# EAGLE design Adafruit_NeoParticle24 (EAGLE 6.6.0)
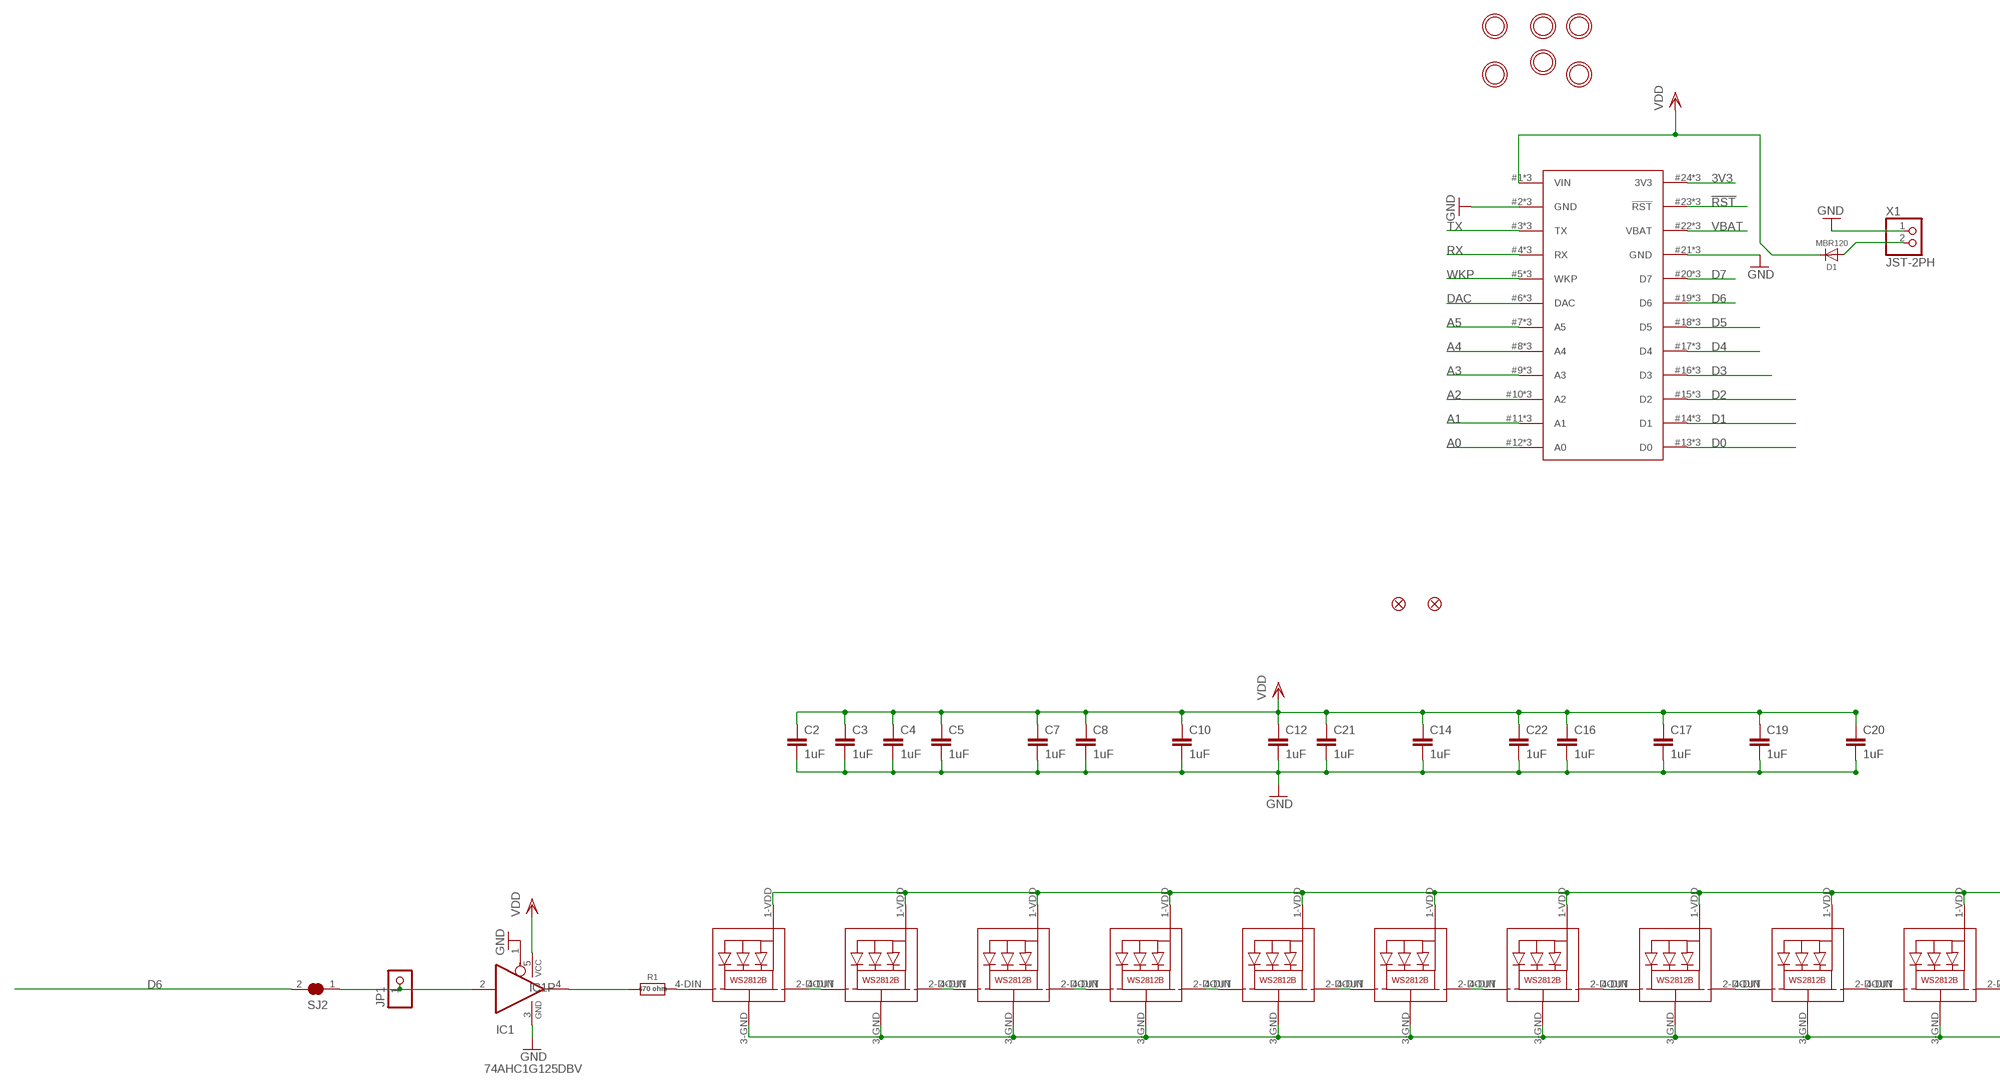
[diagram p0: schematic, sheet 1, part 1 of 2]
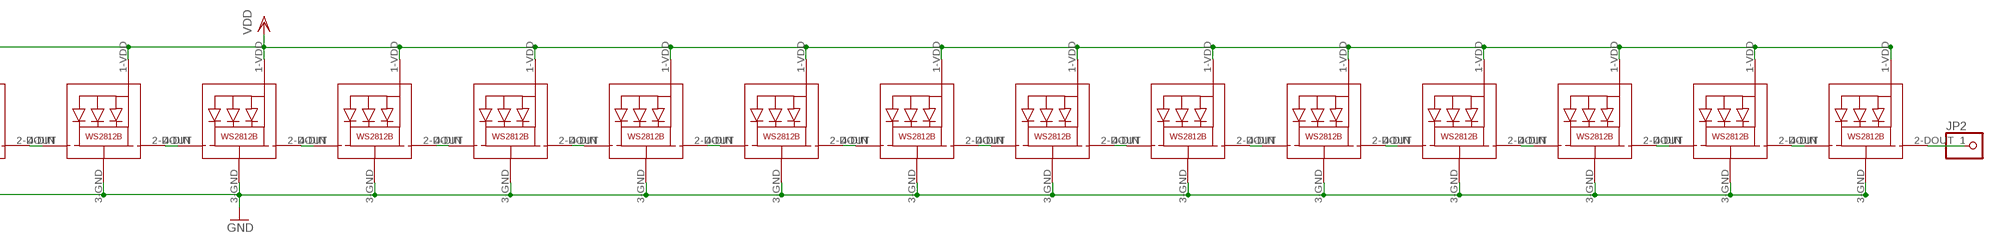
[diagram p1: schematic, sheet 1, part 2 of 2]

## Parts
C2  1uF  C-EUC0603  [C0603]
C3  1uF  C-EUC0603  [C0603]
C4  1uF  C-EUC0603  [C0603]
C5  1uF  C-EUC0603  [C0603]
C7  1uF  C-EUC0603  [C0603]
C8  1uF  C-EUC0603  [C0603]
C10  1uF  C-EUC0603  [C0603]
C12  1uF  C-EUC0603  [C0603]
C14  1uF  C-EUC0603  [C0603]
C16  1uF  C-EUC0603  [C0603]
C17  1uF  C-EUC0603  [C0603]
C19  1uF  C-EUC0603  [C0603]
C20  1uF  C-EUC0603  [C0603]
C21  1uF  C-EUC0603  [C0603]
C22  1uF  C-EUC0603  [C0603]
D1  MBR120  DIODESOD-123  [SOD-123]
FID1  FIDUCIAL""  [FIDUCIAL_1MM]
FID2  FIDUCIAL""  [FIDUCIAL_1MM]
IC1  74AHC1G125DBV  [SOT23-5]
JP1  HEADER-1X1ROUND  [1X01_ROUND]
JP2  PINHD-1X1CB  [1X01-CLEANBIG]
LED1  WS2812B5050  WS2812B5050-NARROW  [WS2812B-NARROW]
LED2  WS2812B5050  WS2812B5050-NARROW  [WS2812B-NARROW]
LED3  WS2812B5050  WS2812B5050-NARROW  [WS2812B-NARROW]
LED4  WS2812B5050  WS2812B5050-NARROW  [WS2812B-NARROW]
LED5  WS2812B5050  WS2812B5050-NARROW  [WS2812B-NARROW]
LED6  WS2812B5050  WS2812B5050-NARROW  [WS2812B-NARROW]
LED7  WS2812B5050  WS2812B5050-NARROW  [WS2812B-NARROW]
LED8  WS2812B5050  WS2812B5050-NARROW  [WS2812B-NARROW]
LED9  WS2812B5050  WS2812B5050-NARROW  [WS2812B-NARROW]
LED10  WS2812B5050  WS2812B5050-NARROW  [WS2812B-NARROW]
LED11  WS2812B5050  WS2812B5050-NARROW  [WS2812B-NARROW]
LED12  WS2812B5050  WS2812B5050-NARROW  [WS2812B-NARROW]
LED13  WS2812B5050  WS2812B5050-NARROW  [WS2812B-NARROW]
LED14  WS2812B5050  WS2812B5050-NARROW  [WS2812B-NARROW]
LED15  WS2812B5050  WS2812B5050-NARROW  [WS2812B-NARROW]
LED16  WS2812B5050  WS2812B5050-NARROW  [WS2812B-NARROW]
LED17  WS2812B5050  WS2812B5050-NARROW  [WS2812B-NARROW]
LED18  WS2812B5050  WS2812B5050-NARROW  [WS2812B-NARROW]
LED19  WS2812B5050  WS2812B5050-NARROW  [WS2812B-NARROW]
LED20  WS2812B5050  WS2812B5050-NARROW  [WS2812B-NARROW]
LED21  WS2812B5050  WS2812B5050-NARROW  [WS2812B-NARROW]
LED22  WS2812B5050  WS2812B5050-NARROW  [WS2812B-NARROW]
LED23  WS2812B5050  WS2812B5050-NARROW  [WS2812B-NARROW]
LED24  WS2812B5050  WS2812B5050-NARROW  [WS2812B-NARROW]
R1  470 ohm  RESISTOR_0603_NOOUT  [0603-NO]
SJ2  SOLDERJUMPER_CLOSED  [SOLDERJUMPER_CLOSEDWIRE]
U$2  PHOTON  SPARK_CORE  [SPARK_CORE_STACKABLE]
U$3  MOUNTINGHOLE3.0THIN  [MOUNTINGHOLE_3.0_PLATEDTHIN]
U$4  MOUNTINGHOLE3.0THIN  [MOUNTINGHOLE_3.0_PLATEDTHIN]
U$5  MOUNTINGHOLE3.0THIN  [MOUNTINGHOLE_3.0_PLATEDTHIN]
U$6  MOUNTINGHOLE3.0THIN  [MOUNTINGHOLE_3.0_PLATEDTHIN]
U$9  MOUNTINGHOLE3.0THIN  [MOUNTINGHOLE_3.0_PLATEDTHIN]
U$10  MOUNTINGHOLE3.0THIN  [MOUNTINGHOLE_3.0_PLATEDTHIN]
X1  JST-2PH  CON_JST_PH_2PIN  [JSTPH2]

## Nets
3V3: U$2.24(3V3) U$2.#24(3V3) U$2.@24(3V3)
!RST: U$2.23(!RST) U$2.#23(!RST) U$2.@23(!RST)
A0: U$2.12(A0) U$2.#12(A0) U$2.@12(A0)
A1: U$2.11(A1) U$2.#11(A1) U$2.@11(A1)
A2: U$2.10(A2) U$2.#10(A2) U$2.@10(A2)
A3: U$2.9(A3) U$2.#9(A3) U$2.@9(A3)
A4: U$2.8(A4) U$2.#8(A4) U$2.@8(A4)
A5: U$2.7(A5) U$2.#7(A5) U$2.@7(A5)
D0: U$2.13(D0) U$2.#13(D0) U$2.@13(D0)
D1: U$2.14(D1) U$2.#14(D1) U$2.@14(D1)
D2: U$2.15(D2) U$2.#15(D2) U$2.@15(D2)
D3: U$2.16(D3) U$2.#16(D3) U$2.@16(D3)
D4: U$2.17(D4) U$2.#17(D4) U$2.@17(D4)
D5: U$2.18(D5) U$2.#18(D5) U$2.@18(D5)
D6: SJ2.2 U$2.19(D6) U$2.#19(D6) U$2.@19(D6)
D7: U$2.20(D7) U$2.#20(D7) U$2.@20(D7)
DAC: U$2.6(DAC) U$2.#6(DAC) U$2.@6(DAC)
DIN: IC1.2(I) JP1.1 SJ2.1
GND: C2.2 C3.2 C4.2 C5.2 C7.2 C8.2 C10.2 C12.2 C14.2 C16.2 C17.2 C19.2 C20.2 C21.2 C22.2 IC1.1(OE) IC1.3(GND) LED1.3-GND(GND) LED2.3-GND(GND) LED3.3-GND(GND) LED4.3-GND(GND) LED5.3-GND(GND) LED6.3-GND(GND) LED7.3-GND(GND) LED8.3-GND(GND) LED9.3-GND(GND) LED10.3-GND(GND) LED11.3-GND(GND) LED12.3-GND(GND) LED13.3-GND(GND) LED14.3-GND(GND) LED15.3-GND(GND) LED16.3-GND(GND) LED17.3-GND(GND) LED18.3-GND(GND) LED19.3-GND(GND) LED20.3-GND(GND) LED21.3-GND(GND) LED22.3-GND(GND) LED23.3-GND(GND) LED24.3-GND(GND) U$2.2(GND) U$2.21(GND) U$2.#2(GND) U$2.#21(GND) U$2.@2(GND) U$2.@21(GND) X1.1
N$1: LED1.2-DOUT(DO) LED2.4-DIN(DI)
N$2: LED2.2-DOUT(DO) LED3.4-DIN(DI)
N$3: LED3.2-DOUT(DO) LED4.4-DIN(DI)
N$4: LED4.2-DOUT(DO) LED5.4-DIN(DI)
N$5: LED5.2-DOUT(DO) LED6.4-DIN(DI)
N$6: LED6.2-DOUT(DO) LED7.4-DIN(DI)
N$7: LED7.2-DOUT(DO) LED8.4-DIN(DI)
N$8: LED8.2-DOUT(DO) LED9.4-DIN(DI)
N$9: LED9.2-DOUT(DO) LED10.4-DIN(DI)
N$10: LED10.2-DOUT(DO) LED11.4-DIN(DI)
N$11: LED11.2-DOUT(DO) LED12.4-DIN(DI)
N$12: LED12.2-DOUT(DO) LED13.4-DIN(DI)
N$13: LED13.2-DOUT(DO) LED14.4-DIN(DI)
N$14: LED14.2-DOUT(DO) LED15.4-DIN(DI)
N$15: LED15.2-DOUT(DO) LED16.4-DIN(DI)
N$16: LED16.2-DOUT(DO) LED17.4-DIN(DI)
N$17: LED17.2-DOUT(DO) LED18.4-DIN(DI)
N$18: LED18.2-DOUT(DO) LED19.4-DIN(DI)
N$19: LED19.2-DOUT(DO) LED20.4-DIN(DI)
N$20: LED20.2-DOUT(DO) LED21.4-DIN(DI)
N$21: LED21.2-DOUT(DO) LED22.4-DIN(DI)
N$22: LED22.2-DOUT(DO) LED23.4-DIN(DI)
N$23: LED23.2-DOUT(DO) LED24.4-DIN(DI)
N$24: JP2.1 LED24.2-DOUT(DO)
N$25: LED1.4-DIN(DI) R1.2
N$26: IC1.4(O) R1.1
N$28: D1.A X1.2
RX: U$2.4(RX) U$2.#4(RX) U$2.@4(RX)
TX: U$2.3(TX) U$2.#3(TX) U$2.@3(TX)
VBAT: U$2.22(VBAT) U$2.#22(VBAT) U$2.@22(VBAT)
VDD: C2.1 C3.1 C4.1 C5.1 C7.1 C8.1 C10.1 C12.1 C14.1 C16.1 C17.1 C19.1 C20.1 C21.1 C22.1 D1.C IC1.5(VCC) LED1.1-VDD(VDD) LED2.1-VDD(VDD) LED3.1-VDD(VDD) LED4.1-VDD(VDD) LED5.1-VDD(VDD) LED6.1-VDD(VDD) LED7.1-VDD(VDD) LED8.1-VDD(VDD) LED9.1-VDD(VDD) LED10.1-VDD(VDD) LED11.1-VDD(VDD) LED12.1-VDD(VDD) LED13.1-VDD(VDD) LED14.1-VDD(VDD) LED15.1-VDD(VDD) LED16.1-VDD(VDD) LED17.1-VDD(VDD) LED18.1-VDD(VDD) LED19.1-VDD(VDD) LED20.1-VDD(VDD) LED21.1-VDD(VDD) LED22.1-VDD(VDD) LED23.1-VDD(VDD) LED24.1-VDD(VDD) U$2.1(VIN) U$2.#1(VIN) U$2.@1(VIN)
WKP: U$2.5(WKP) U$2.#5(WKP) U$2.@5(WKP)

## Library data of the parts
C2-C5 C7 C8 C10 C12 C14 C16 C17 C19-C22 = rcl:C-EU: CAPACITOR, European symbol
D1 = microbuilder:DIODE: Diode SMA Model Volts Amps Type Vf Ir Digikey # Notes SSA34-E3 40V 3A Schottky 480mV @ 3A 200uA @ 40V SSA34-E3/61TGITR-ND CDBA120-G 20V 1A Schottky 500mV @ 1A 500uA @ 20V 641-1014-6-ND REEL MBRA210 10V 2A Schottky 350mV @ 2A 700uA @ 10V MBRA210LT3 SOD-123 Model Volts Amps Type Vf Ir Order # Notes BAT54T1G 30V 200mA Schottky 800mV @ 200mA 2uA @ 25V BAT54T1GOSTR-ND B0530W 30V 500mA Schottky 430mV @ 500mA 130uA @ 30V B0530W-FDICT-ND REEL MBR120 20V 1A Schottky 340mV @ 1A MBR120VLSFT1GOSCT-ND SOD-323 Model Volts Amps Type Vf Ir Order # Notes PMEG2005EJ 20V 500mA Schottky 355mV @ 500mA 568-4110-1-ND ZLLS410 10V 570mA Schottky 380mV @ 570mA ZLLS410CT-ND 1N4148WS 75V 150mA Silicon/Simple 1V 1N4148WSFSCT-ND REEL SOD-523 Model Volts Amps Type Vf Ir Order # Notes BAT54XV2 30V 200mA Schottky 0.8V @ 100mA BAT54XV2CT-ND TB751S 30V 30mA Schottky RB751S-40TE61CT-ND SOT23-R/W (R = Solder Paste/Reflow Ovens, W = Hand-Soldering) Model Volts Amps Type Vf Ir Order # Notes BAT54FILM 40V 300mA Schottky 497-7162-1-ND POWERDI-5 Model Volts Amps Type Vf Ir Order # Notes PDS560 60V 5A Schottky 670mV @ 5A 150uA @ 60V PDS560DICT-ND
FID1 FID2 = microbuilder:FIDUCIAL: Fiducial Alignment Points Various fiducial points for machine vision alignment.; BOM: EXCLUDE
IC1 = 74xx-little-us:74*1G125: Single Bus Buffer Gate with 3-State Output
JP1 = microbuilder:HEADER-1X1: PIN HEADER
JP2 = NeoPixelRing:PINHD-1X1: Pin header 1x1 for 0.1" spacing With round pins
LED1-LED24 = microbuilder:WS2812B5050
R1 = microbuilder:RESISTOR: Resistors For new designs, use the packages preceded by an '_' character since they are more reliable: The following footprints should be used on most boards: _0402 - Standard footprint for regular board layouts _0603 - Standard footprint for regular board layouts _0805 - Standard footprint for regular board layouts _1206 - Standard footprint for regular board layouts For extremely tight-pitch boards where space is at a premium, the following 'micro-pitch' footprints can be used (smaller pads, no silkscreen outline, etc.): _0402MP - Micro-pitch footprint for very dense/compact boards _0603MP - Micro-pitch footprint for very dense/compact boards _0805MP - Micro-pitch footprint for very dense/compact boards _1206MP - Micro-pitch footprint for very dense/compact boards
SJ2 = microbuilder:SOLDERJUMPER_CLOSED: Solder Jumper - Closed These solder jumpers are closed by default CLOSEDWIRE - 10 mil trace between pads that can be cut and resoldered later CLOSEDPERM - 63 mil trace between pads for a permanent connection (used to 'bridge' two signals, a shameless hack for Eagle). Can double as a test point as well (no cream layer)
U$2 = Spark:SPARK_CORE
U$3-U$6 U$9 U$10 = microbuilder:MOUNTINGHOLE: Mounting Hole For #2 screws (0.086"/2.18mm width, 0.094"/2.4mm hole) use 2.5mm; BOM: EXCLUDE
X1 = microbuilder:CON_JST_PH_2PIN: JST 2-Pin Right-Angle Connector PH-Series - 4UConnector: 17311 SH-Series - 4UConnector: 07278

## Board
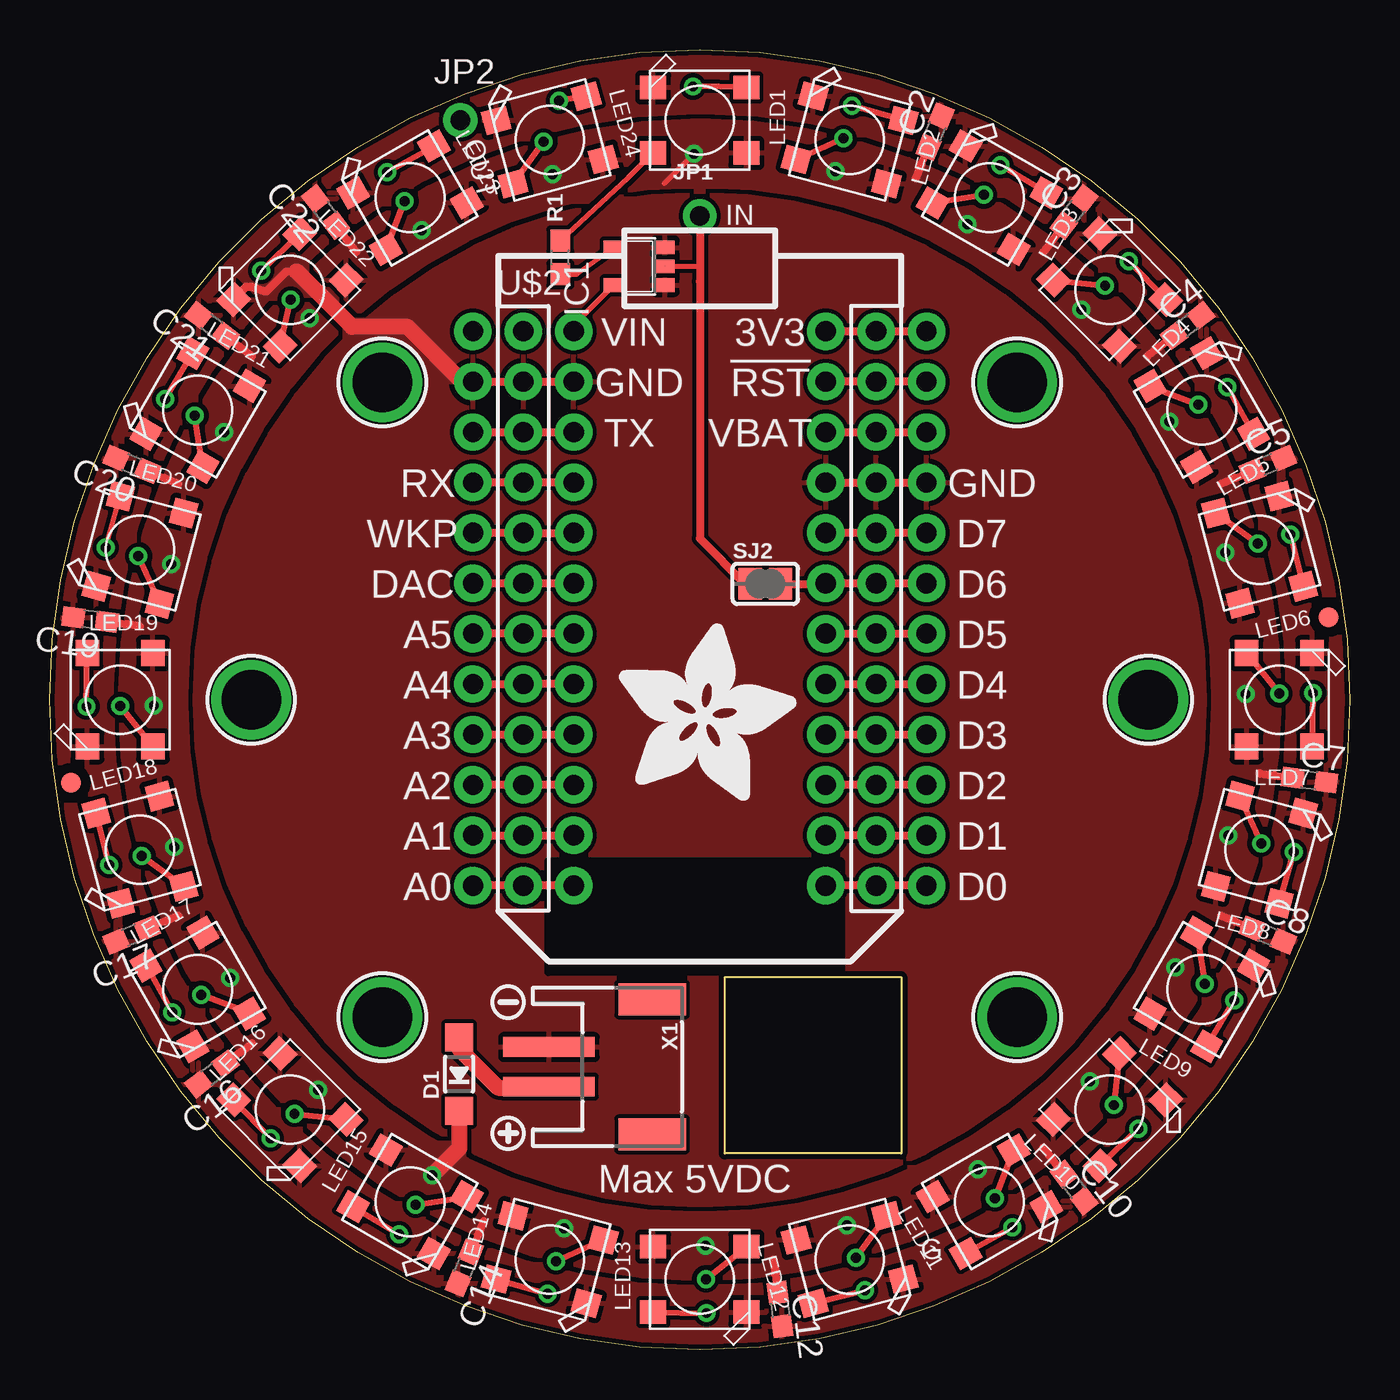
[diagram p2: board, top side]
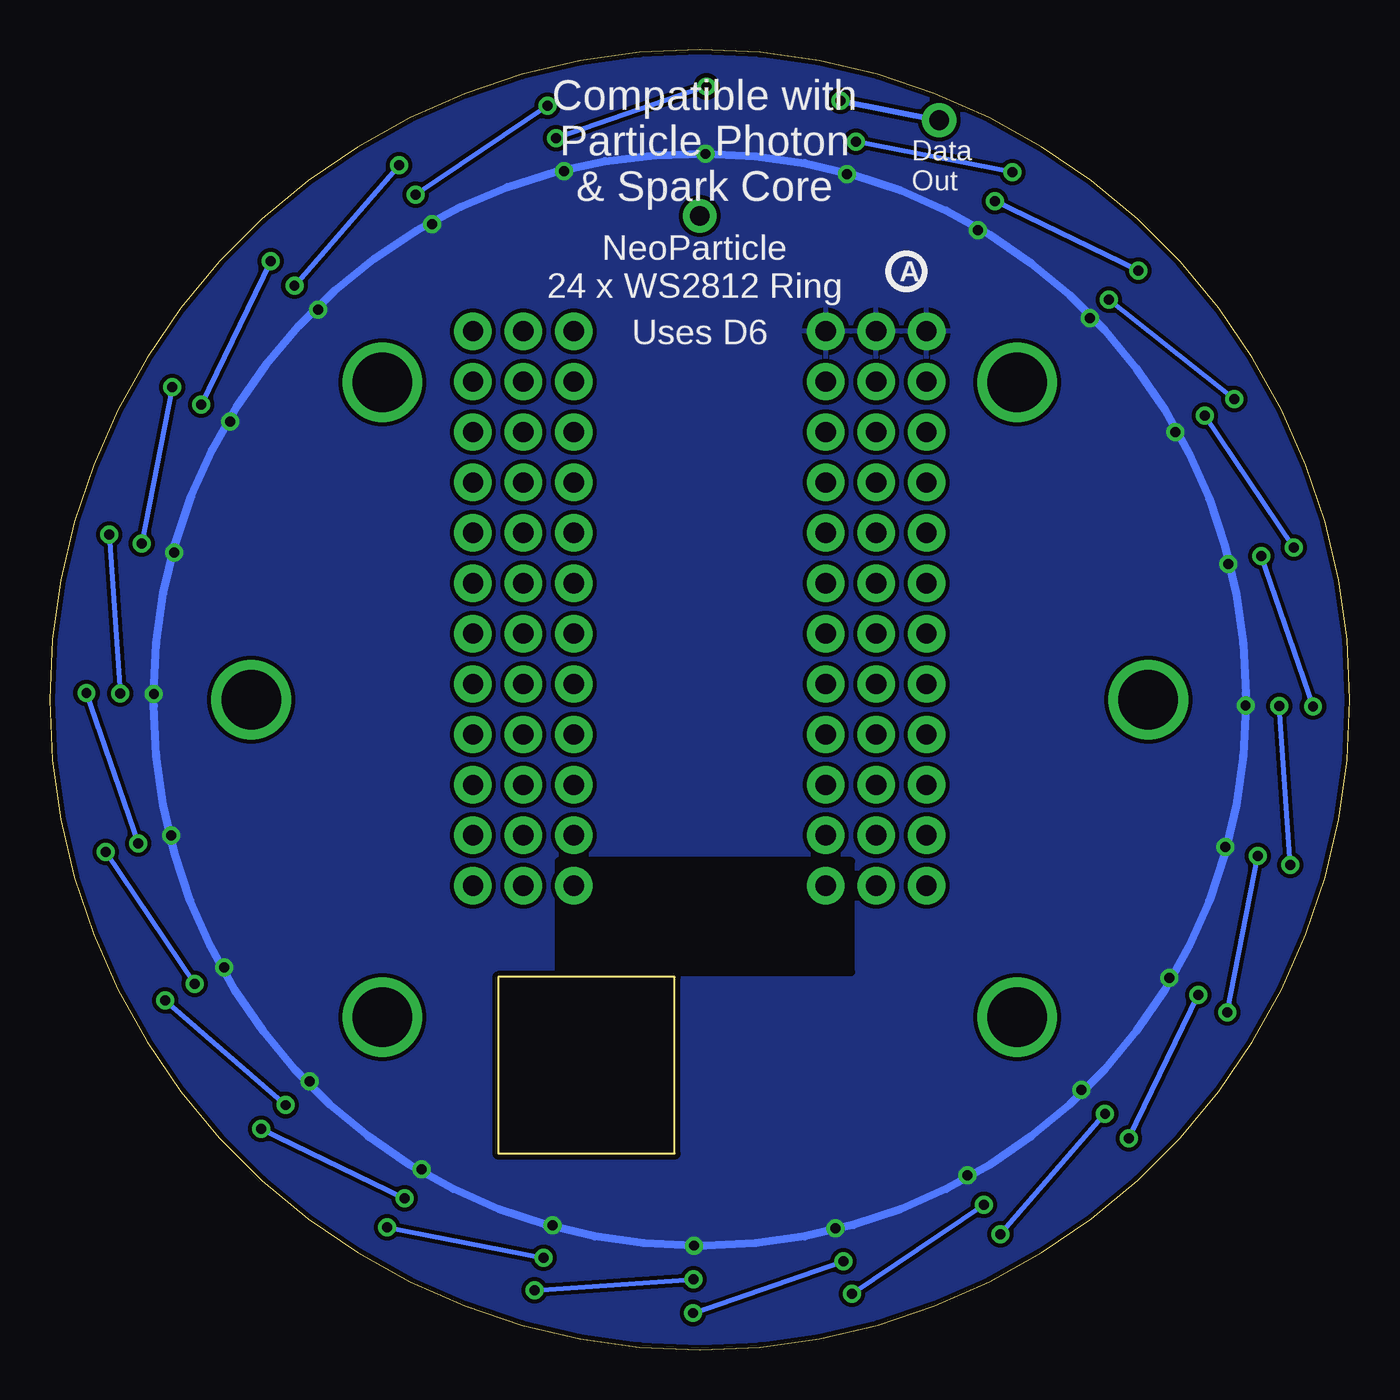
[diagram p3: board, bottom side, seen from below]

Size 65.53 x 65.53 mm. Coordinates in mm from the lower left corner, seen from the top.
Outline: 0,32.77 arc-90 32.77,65.53 arc-90 65.53,32.77 arc-90 32.77,0 arc-90 0,32.77
Outline: 42.93,18.8 42.93,9.91 34.04,9.91 34.04,18.8 42.93,18.8
Copper layers (1*16): Top 0.035mm / dielectric 1.5mm / Bottom 0.035mm
Design rules "adafruit": minimum track width 8mil, minimum drill 15.5mil, track to track 8mil, track to pad 8mil, pad to pad 8mil, via to via 8mil, smd to smd 8mil, copper to edge 10mil, drill to drill 8mil, minimum pad ring 10mil, minimum via ring 8mil, stop-mask expansion 4mil, vias tented up to drill 20mil, thermal gap 10mil
tRestrict: area 25.1,19 to 39.9,24.6
bRestrict: area 25.1,19 to 39.9,24.6

### Footprints (pad centres in the part's own frame; a part is rotated, then mirrored left to right if it is on the bottom)
C0603 = smd 1.1 x 1: 1 -0.85,0; 2 0.85,0
SOD-123 = smd 1.4 x 1.4: A 1.85,0; C -1.85,0
FIDUCIAL_1MM = smd 1 x 1: 1 0,0
SOT23-5 = smd 0.69 x 0.99: 1 -0.95,-1.29; 2 0,-1.29; 3 0.95,-1.29; 4 0.95,1.3; 5 -0.95,1.3
1X01_ROUND = drill 1 pad 1.676: 1 0,0
1X01-CLEANBIG = drill 1 pad 1.727: 1 0,0
WS2812B-NARROW = smd 1.3 x 1.2: 1-VDD 2.35,-1.65; 2-DOUT 2.35,1.65; 3-GND -2.35,1.65; 4-DIN -2.35,-1.65
0603-NO = smd 1.1 x 1: 1 -0.85,0; 2 0.85,0
SOLDERJUMPER_CLOSEDWIRE = smd 1.168 x 1.6: 1 -0.762,0; 2 0.762,0 | smd 0.635 x 0.203: WIRE 0,0
SPARK_CORE_STACKABLE = drill 1.016 pad 1.88: 1 -8.89,13.97; 2 -8.89,11.43; 3 -8.89,8.89; 4 -8.89,6.35; 5 -8.89,3.81; 6 -8.89,1.27; 7 -8.89,-1.27; 8 -8.89,-3.81; 9 -8.89,-6.35; 10 -8.89,-8.89; 11 -8.89,-11.43; 12 -8.89,-13.97; 13 8.89,-13.97; 14 8.89,-11.43; 15 8.89,-8.89; 16 8.89,-6.35; 17 8.89,-3.81; 18 8.89,-1.27; 19 8.89,1.27; 20 8.89,3.81; 21 8.89,6.35; 22 8.89,8.89; 23 8.89,11.43; 24 8.89,13.97; #1 -6.35,13.97; #2 -6.35,11.43; #3 -6.35,8.89; #4 -6.35,6.35; #5 -6.35,3.81; #6 -6.35,1.27; #7 -6.35,-1.27; #8 -6.35,-3.81; #9 -6.35,-6.35; #10 -6.35,-8.89; #11 -6.35,-11.43; #12 -6.35,-13.97; #13 11.43,-13.97; #14 11.43,-11.43; #15 11.43,-8.89; #16 11.43,-6.35; #17 11.43,-3.81; #18 11.43,-1.27; #19 11.43,1.27; #20 11.43,3.81; #21 11.43,6.35; #22 11.43,8.89; #23 11.43,11.43; #24 11.43,13.97; @1 -11.43,13.97; @2 -11.43,11.43; @3 -11.43,8.89; @4 -11.43,6.35; @5 -11.43,3.81; @6 -11.43,1.27; @7 -11.43,-1.27; @8 -11.43,-3.81; @9 -11.43,-6.35; @10 -11.43,-8.89; @11 -11.43,-11.43; @12 -11.43,-13.97; @13 6.35,-13.97; @14 6.35,-11.43; @15 6.35,-8.89; @16 6.35,-6.35; @17 6.35,-3.81; @18 6.35,-1.27; @19 6.35,1.27; @20 6.35,3.81; @21 6.35,6.35; @22 6.35,8.89; @23 6.35,11.43; @24 6.35,13.97
MOUNTINGHOLE_3.0_PLATEDTHIN = drill 3 pad 3.6: P$1 0,0
JSTPH2 = smd 1 x 4.6: 1 -1,-3.7; 2 1,-3.7 | smd 1.6 x 3.4: NC1 -3.4,1.5; NC2 3.4,1.5

### Placement (x,y rotation side)
C2  44.62,61.4 67.5 top
C3  51.63,57.35 52.5 top
C4  57.35,51.63 37.5 top
C5  61.4,44.62 22.5 top
C7  63.49,28.72 352.5 top
C8  61.4,20.91 337.5 top
C10  51.63,8.18 307.5 top
C12  36.81,2.04 277.5 top
C14  20.91,4.14 247.5 top
C16  8.18,13.9 217.5 top
C17  4.14,20.91 202.5 top
C19  2.04,36.81 172.5 top
C20  4.14,44.62 157.5 top
C21  8.18,51.63 142.5 top
C22  13.9,57.35 127.5 top
D1  20.64,13.9 90 top
FID1  1.07,28.57 0 top
FID2  64.47,36.93 0 top
IC1  29.72,54.61 90 top
JP1  32.77,57.15 0 top
JP2  20.7,61.98 0 top
LED1  32.77,61.98 0 top
LED2  40.33,60.98 345 top
LED3  47.37,58.06 330 top
LED4  53.42,53.42 315 top
LED5  58.06,47.37 300 top
LED6  60.98,40.33 285 top
LED7  61.98,32.77 270 top
LED8  60.98,25.21 255 top
LED9  58.06,18.16 240 top
LED10  53.42,12.11 225 top
LED11  47.37,7.47 210 top
LED12  40.33,4.55 195 top
LED13  32.77,3.56 180 top
LED14  25.21,4.55 165 top
LED15  18.16,7.47 150 top
LED16  12.11,12.11 135 top
LED17  7.47,18.16 120 top
LED18  4.55,25.21 105 top
LED19  3.56,32.77 90 top
LED20  4.55,40.33 75 top
LED21  7.47,47.37 60 top
LED22  12.11,53.42 45 top
LED23  18.16,58.06 30 top
LED24  25.21,60.98 15 top
R1  25.73,55.06 90 top
SJ2  36.07,38.61 0 top
U$1  [ADAFRUIT_9MM]  28.7,27.69 0 top
U$2  32.77,37.37 0 top
U$3  48.77,48.77 0 top
U$4  16.77,48.77 0 top
U$5  16.77,16.77 0 top
U$6  48.77,16.77 0 top
U$7  [SYMBOL_PLUS]  23.11,10.92 0 top
U$8  [SYMBOL_MINUS]  23.11,17.53 0 top
U$9  10.16,32.77 0 top
U$10  55.37,32.77 0 top
U$11  [PCBFEAT-REV-040]  22.35,54.36 0 bottom
X1  28.87,14.27 270 top

### Tracks (layer width: path | path; a pad name or v marks a point on that pad's centre or on a via)
3V3
  Top 0.406: U$2.@24 U$2.24 U$2.#24
!RST
  Top 0.406: U$2.#23 U$2.23 U$2.@23
A0
  Top 0.406: U$2.#12 U$2.12 U$2.@12
A1
  Top 0.406: U$2.@11 U$2.11 U$2.#11
A2
  Top 0.406: U$2.#10 U$2.10 U$2.@10
A3
  Top 0.406: U$2.@9 U$2.9 U$2.#9
A4
  Top 0.406: U$2.@8 U$2.8 U$2.#8
A5
  Top 0.406: U$2.#7 U$2.7 U$2.@7
D0
  Top 0.406: U$2.#13 U$2.13 U$2.@13
D1
  Top 0.406: U$2.@14 U$2.14 U$2.#14
D2
  Top 0.406: U$2.#15 U$2.15 U$2.@15
D3
  Top 0.406: U$2.@16 U$2.16 U$2.#16
D4
  Top 0.406: U$2.@17 U$2.17 U$2.#17
D5
  Top 0.406: U$2.@18 U$2.18 U$2.#18
D6
  Top 0.406: U$2.#19 U$2.19 U$2.@19 39.12,38.61 SJ2.2
D7
  Top 0.406: U$2.#20 U$2.20 39.85,41.18 | 39.85,41.18 39.62,41.4 | 39.85,41.18 U$2.@20 39.09,41.15
DAC
  Top 0.406: U$2.@6 U$2.6 U$2.#6
DIN
  Top 0.254: 32.77,53.91 32.77,53.85 | IC1.2 32.77,54.61
  Top 0.406: JP1.1 32.77,54.61 32.77,53.85 32.77,40.89 35.05,38.61 SJ2.1
GND
  Top 0.406: U$2.@2 U$2.2 U$2.#2 26.44,48.77 | U$2.@21 U$2.21 U$2.#21 | LED22.3-GND 9.28,52.97 9.91,53.59 10.16,53.59 10.92,53.34 11.94,54.36 12.45,54.36
  Top 0.813: U$2.@2 20.8,48.8 18.03,51.56 15.24,51.56 12.45,54.36
  pour Top (rank 3): -0.25,66.04 0.51,-0.76 66.29,-1.27 65.53,65.53
  pour Top: 7.37,32.77 arc90 32.77,7.37 arc90 58.17,32.77 arc90 32.77,58.17 arc90
N$1  (via drill 0.5)
  Top 0.305: LED2.4-DIN v40.02,61.06 | LED1.2-DOUT v32.43,63.67
  Bottom 0.254: v32.43,63.67 v40.02,61.06
N$2  (via drill 0.5)
  Top 0.305: LED2.2-DOUT v40.44,62.71 | LED3.4-DIN v47.09,58.22
  Bottom 0.254: v40.44,62.71 v47.09,58.22
N$3  (via drill 0.5)
  Top 0.305: LED3.2-DOUT v47.93,59.7 | LED4.4-DIN v53.19,53.64
  Bottom 0.254: v47.93,59.7 v53.19,53.64
N$4  (via drill 0.5)
  Top 0.305: LED4.2-DOUT v54.38,54.86 | LED5.4-DIN v57.9,47.65
  Bottom 0.254: v54.38,54.86 v57.9,47.65
N$5  (via drill 0.5)
  Top 0.305: v59.36,48.51 LED5.2-DOUT | LED6.4-DIN v60.9,40.63
  Bottom 0.254: v59.36,48.51 v60.9,40.63
N$6  (via drill 0.5)
  Top 0.305: v62.53,41.09 LED6.2-DOUT | LED7.4-DIN v61.97,33.09
  Bottom 0.254: v62.53,41.09 v61.97,33.09
N$7  (via drill 0.5)
  Top 0.305: LED7.2-DOUT v63.67,33.1 | LED8.4-DIN v61.06,25.51
  Bottom 0.254: v63.67,33.1 v61.06,25.51
N$8  (via drill 0.5)
  Top 0.305: LED8.2-DOUT v62.71,25.09 | LED9.4-DIN v58.22,18.44
  Bottom 0.254: v62.71,25.09 v58.22,18.44
N$9  (via drill 0.5)
  Top 0.305: LED9.2-DOUT v59.7,17.6 | LED10.4-DIN v53.64,12.34
  Bottom 0.254: v59.7,17.6 v53.64,12.34
N$10  (via drill 0.5)
  Top 0.305: LED10.2-DOUT v54.86,11.15 | LED11.4-DIN v47.65,7.63
  Bottom 0.254: v54.86,11.15 v47.65,7.63
N$11  (via drill 0.5)
  Top 0.305: LED11.2-DOUT v48.51,6.17 | v40.63,4.63 LED12.4-DIN
  Bottom 0.254: v48.51,6.17 v40.63,4.63
N$12  (via drill 0.5)
  Top 0.305: v33.09,3.56 LED13.4-DIN | LED12.2-DOUT v41.09,3
  Bottom 0.254: v41.09,3 v33.09,3.56
N$13  (via drill 0.5)
  Top 0.305: LED13.2-DOUT v33.1,1.86 | v25.51,4.47 LED14.4-DIN
  Bottom 0.254: v33.1,1.86 v25.51,4.47
N$14  (via drill 0.5)
  Top 0.305: LED14.2-DOUT v25.09,2.82 | v18.44,7.31 LED15.4-DIN
  Bottom 0.254: v25.09,2.82 v18.44,7.31
N$15  (via drill 0.5)
  Top 0.305: LED15.2-DOUT v17.6,5.83 | v12.34,11.89 LED16.4-DIN
  Bottom 0.254: v17.6,5.83 v12.34,11.89
N$16  (via drill 0.5)
  Top 0.305: LED16.2-DOUT v11.15,10.67 | LED17.4-DIN v7.63,17.89
  Bottom 0.254: v11.15,10.67 v7.63,17.89
N$17  (via drill 0.5)
  Top 0.305: LED17.2-DOUT v6.17,17.02 | LED18.4-DIN v4.63,24.9
  Bottom 0.254: v6.17,17.02 v4.63,24.9
N$18  (via drill 0.5)
  Top 0.305: v3,24.44 LED18.2-DOUT | v3.56,32.45 LED19.4-DIN
  Bottom 0.254: v3,24.44 v3.56,32.45
N$19  (via drill 0.5)
  Top 0.305: v1.86,32.43 LED19.2-DOUT | LED20.4-DIN v4.47,40.02
  Bottom 0.254: v1.86,32.43 v4.47,40.02
N$20  (via drill 0.5)
  Top 0.254: v2.82,40.44 LED20.2-DOUT
  Top 0.305: LED21.4-DIN v7.31,47.09
  Bottom 0.254: v2.82,40.44 v7.31,47.09
N$21  (via drill 0.5)
  Top 0.305: v5.83,47.93 LED21.2-DOUT | LED22.4-DIN v12.14,52.94
  Bottom 0.254: v5.83,47.93 v12.14,52.94
N$22  (via drill 0.5)
  Top 0.305: LED22.2-DOUT v10.67,54.38 | LED23.4-DIN v17.89,57.9
  Bottom 0.254: v10.67,54.38 v17.89,57.9
N$23  (via drill 0.5)
  Top 0.305: LED24.4-DIN v24.9,60.9 | v17.02,59.36 LED23.2-DOUT
  Bottom 0.254: v17.02,59.36 v24.9,60.9
N$24  (via drill 0.5)
  Top 0.305: LED24.2-DOUT v25.67,62.97
  Bottom 0.305: v25.67,62.97 JP2.1
N$25
  Top 0.254: R1.2 29.18,59.09 LED1.4-DIN
N$26
  Top 0.254: R1.1 26.56,54.21 IC1.4
N$28
  Top 0.813: D1.A 20.64,15.18 22.61,13.21 25.11,13.21 X1.2
RX
  Top 0.406: U$2.@4 U$2.4 U$2.#4
TX
  Top 0.406: U$2.@3 U$2.3 U$2.#3
VBAT
  Top 0.406: U$2.@22 U$2.22 U$2.#22
VDD  (via drill 0.5)
  Top 0.254: 30.99,58.8 v32.47,60.27 | U$2.#1 26.42,51.66 IC1.5
  Top 0.406: 43.65,59.05 43.94,59.75 C2.1 | 50.08,55.33 50.55,55.94 C3.1 | 55.33,50.08 55.94,50.55 C4.1 | 59.05,43.65 59.75,43.94 C5.1 | 60.97,29.05 61.73,28.95 C7.1 | 59.05,21.88 59.75,21.59 C8.1 | 50.08,10.2 50.55,9.59 C10.1 | 36.48,4.56 36.58,3.81 C12.1 | 21.88,6.48 21.59,5.78 C14.1 | 10.2,15.45 9.59,14.98 C16.1 | 6.48,21.88 5.78,21.59 C17.1 | 4.56,36.48 3.81,36.58 C19.1 | 6.48,43.65 5.78,43.94 C20.1 | 10.2,50.08 9.59,50.55 C21.1 | 15.45,55.33 14.98,55.94 C22.1
  Top 0.813: D1.C 20.64,10.16 v19.27,8.79
  Bottom 0.406: v32.47,60.27 arc90 5.26,33.07 v5.26,32.47 arc90 32.47,5.26 v33.07,5.26 arc90 60.27,32.47 v60.27,33.07 arc91 v32.47,60.27
  other vias: 39.6,59.41 46.26,56.74 52.01,52.43 56.44,46.78 59.26,40.18 59.41,25.94 56.74,19.27 52.43,13.53 46.78,9.09 40.18,6.27 25.94,6.12 13.53,13.1 9.09,18.75 6.27,25.36 6.12,39.6 8.79,46.26 13.1,52.01 18.75,56.44 25.36,59.26
  pour Bottom: 0.25,66.04 -0.51,-1.27 66.29,-1.02 67.06,66.29
  pour Top (isolate 0.254, rank 2): 32.77,61.97 arc-90 61.97,32.77 arc-90 32.77,3.57 arc-180
WKP
  Top 0.406: U$2.@5 U$2.5 U$2.#5

### Text on the board
tPlace: OUT | IN | VIN | 3V3 | GND | !RST | TX | VBAT | RX | GND | WKP | D7 | DAC | D6 | A5 | D5 | A4 | D4 | A3 | D3 | A2 | D2 | A1 | D1 | A0 | D0 | Max 5VDC | G
bPlace: Compatible with / Particle Photon / & Spark Core | Data / Out | NeoParticle / 24 x WS2812 Ring | Uses D6